# Altium schematic sheet batsch-env.SchDoc
size A; SheetNumber: 1; SheetTotal: 1
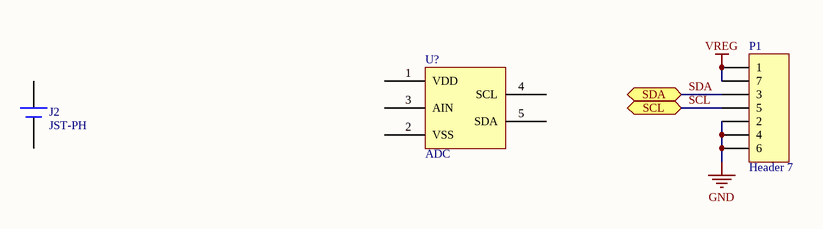
[diagram p0: batsch-env.SchDoc]

## Parts
J2  JST-PH  [JST-PH]
P1  Header 7  [HDR1X7]
U?  ADC

## Ports
SCL (bidir), SDA (bidir)

## Nets
GND: P1.2 P1.4 P1.6
VREG: P1.1 P1.7
SCL: P1.5 ; port SCL
SDA: P1.3 ; port SDA

Not connected (* = marked no-connect by the designer): J2 1(+) 2(-); U? 1(VDD) 2(VSS) 3(AIN) 4(SCL) 5(SDA)

## Library data of the parts
J2 = JST-PH: Input/Output
P1 = Header 7: Header, 7-Pin; LatestRevisionDate: 17-Jul-2002; LatestRevisionNote: Re-released for DXP Platform.; Publisher: Altium Limited
U? = MCP3021xxxxx